# EAGLE design thit_draw103 (EAGLE 9.6.2)
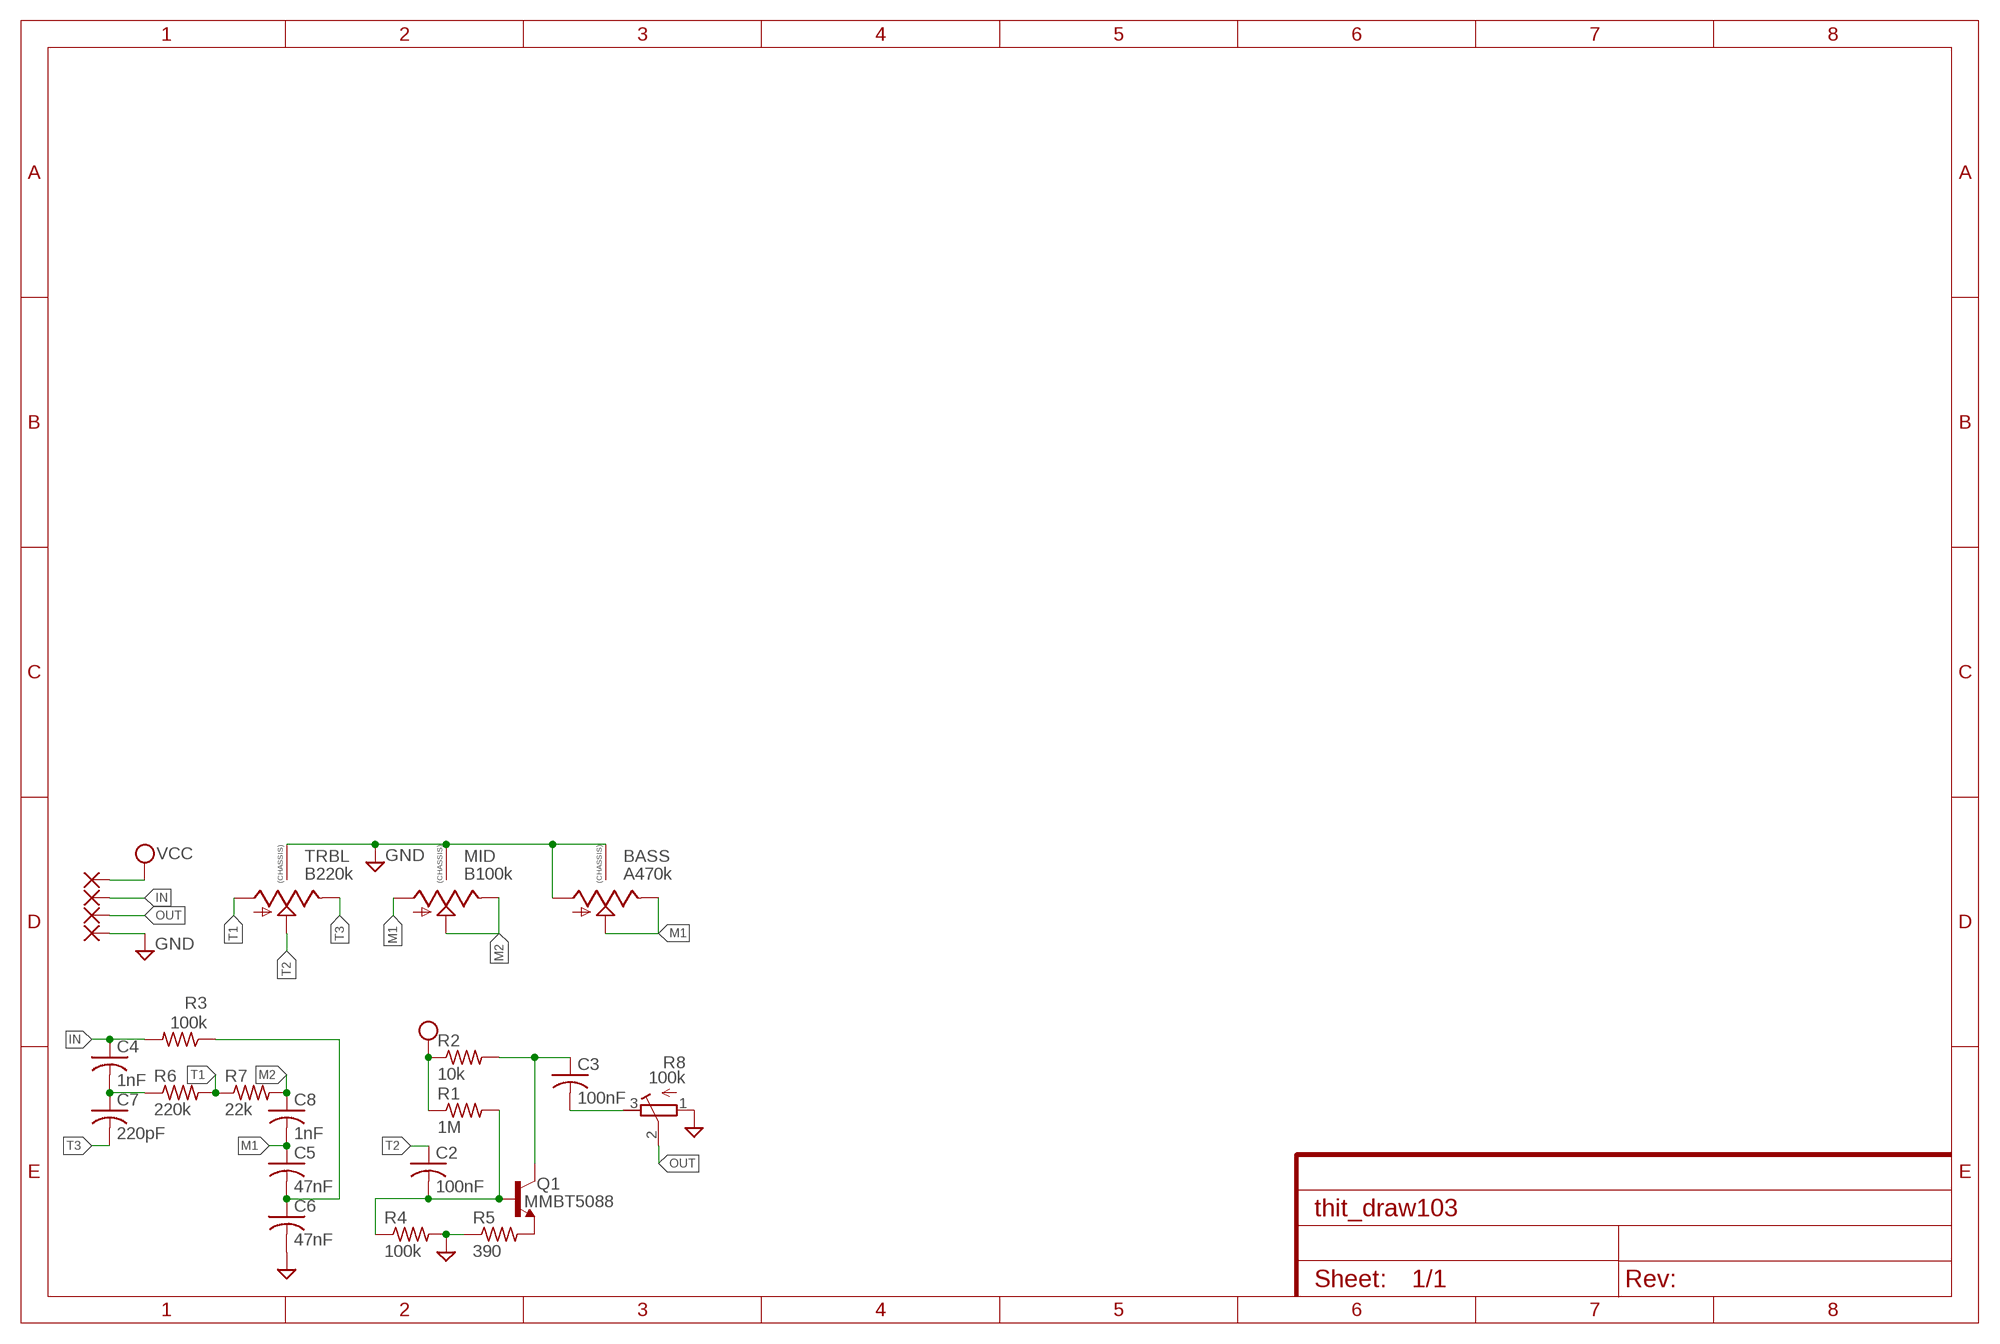
[diagram p0: schematic, sheet 1]

## Parts
BASS  A470k  9MM_SNAP-IN_POT_CHASSIS  [9MM_SNAP-IN_POT]
C2  100nF  C-USC0603  [C0603]
C3  100nF  C-USC0603  [C0603]
C4  1nF  C-USC0603  [C0603]
C5  47nF  C-USC0603  [C0603]
C6  47nF  C-USC0603  [C0603]
C7  220pF  C-USC0603  [C0603]
C8  1nF  C-USC0603  [C0603]
MID  B100k  9MM_SNAP-IN_POT_CHASSIS  [9MM_SNAP-IN_POT]
PAD1  1,6/0,8  [1,6/0,8]
PAD2  1,6/0,8  [1,6/0,8]
PAD3  1,6/0,8  [1,6/0,8]
PAD4  1,6/0,8  [1,6/0,8]
Q1  MMBT5088  [SOT23-BEC]
R1  1M  R-US_R0603  [R0603]
R2  10k  R-US_R0603  [R0603]
R3  100k  R-US_R0603  [R0603]
R4  100k  R-US_R0603  [R0603]
R5  390  R-US_R0603  [R0603]
R6  220k  R-US_R0603  [R0603]
R7  22k  R-US_R0603  [R0603]
R8  100k  R-TRIMM3224X  [RTRIM3224X]
TRBL  B220k  9MM_SNAP-IN_POT_CHASSIS  [9MM_SNAP-IN_POT]

## Nets
GND: BASS.1(A) BASS.CHASSIS1 BASS.CHASSIS2 C6.2 MID.CHASSIS1 MID.CHASSIS2 PAD4.1(P) R4.2 R5.1 R8.1(A) TRBL.CHASSIS1 TRBL.CHASSIS2
IN: C4.1 PAD2.1(P) R3.2
M1: BASS.2(S) BASS.3(E) C5.1 C8.2 MID.1(A)
M2: C8.1 MID.2(S) MID.3(E) R7.2
N$1: C2.2 Q1.B R1.2 R4.1
N$2: C4.2 C7.1 R6.1
N$3: C5.2 C6.1 R3.1
N$4: Q1.E R5.2
N$5: C3.1 Q1.C R2.2
N$6: C3.2 R8.3(E)
OUT: PAD3.1(P) R8.2(S)
T1: R6.2 R7.1 TRBL.1(A)
T2: C2.1 TRBL.2(S)
T3: C7.2 TRBL.3(E)
VCC: PAD1.1(P) R1.1 R2.1

## Library data of the parts
BASS MID TRBL = MusicThingModular:9MM_SNAP-IN_POT_CHASSIS: 9mm vertical snap-in pot, Alpha / Panasonic style, with a connection to the metal chassis for grounding
C2-C8 = adafruit:C-US: CAPACITOR, American symbol
PAD1-PAD4 = wirepad:1,6/0,8: THROUGH-HOLE PAD
Q1 = MMBT5088_:MMBT5088*: NPN TRANSISTOR Check prices <https://pricing.snapeda.com/search/part/MMBT5088/?ref=eda>; AVAILABILITY: Good; DESCRIPTION: Bipolar (BJT) Transistor NPN 30V 100mA 50MHz 350mW Surface Mount SOT-23; MF: ON Semiconductor; MP: MMBT5088; PACKAGE: SOT-23-3 Fairchild Semiconductor; PRICE: None; PURCHASE-URL: https://pricing.snapeda.com/search/part/MMBT5088/?ref=eda
R1-R7 = adafruit:R-US_: RESISTOR, American symbol
R8 = rcl:R-TRIMM: Trimm resistor; SPICEMODEL: X; SPICEPREFIXL: POT

## Board
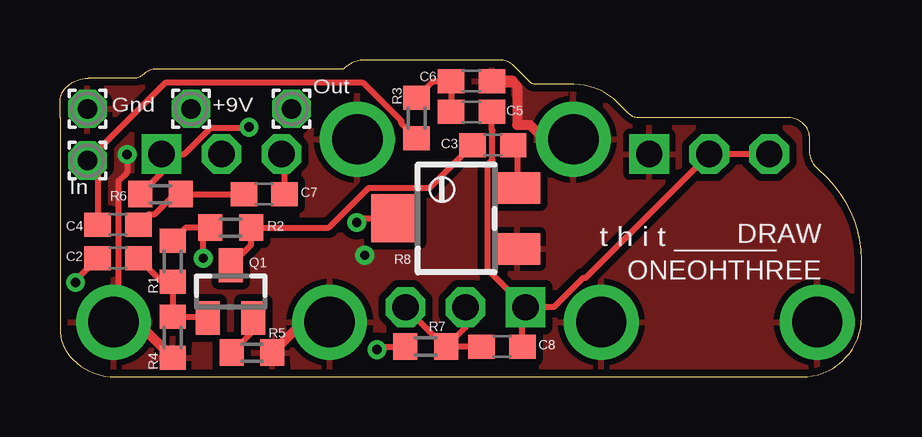
[diagram p1: board, top side]
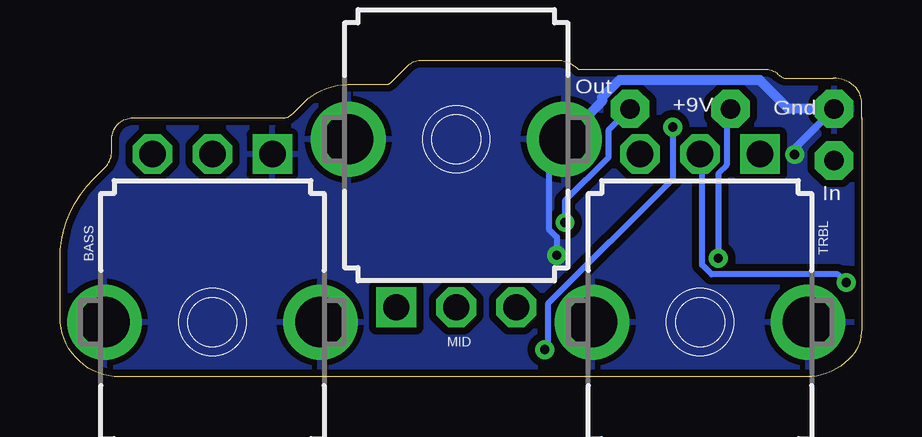
[diagram p2: board, bottom side, seen from below]

Size 33.4 x 13.21 mm. Coordinates in mm from the lower left corner, seen from the top.
Outline: 0,10.79 0,3.05 0,1.99 arc45 0.51,0.76 0.54,0.73 arc45 2.31,0 2.41,0 30.9,0 arc90 33.4,2.5 33.4,4.88 arc45 32,8.26 31.51,8.75 arc-45 31.24,9.4 31.24,9.93 arc45 30.99,10.54 arc45 30.38,10.79 24.13,10.79 arc-45 23.7,10.97 23.24,11.43 arc45 21.4,12.19 19.81,12.19 arc-45 19.59,12.28 18.92,12.95 arc45 18.31,13.21 12.73,13.21 arc45 11.81,12.83 4.04,12.83 arc45 3.43,12.57 arc-45 3.12,12.45 1.17,12.45 arc45 0.25,12.06 arc45 0,11.45 0,10.79
Copper layers (1*16): Top 0.035mm / dielectric 1.5mm / Bottom 0.035mm
Design rules "default *": minimum track width 6mil, minimum drill 0.35mm, track to track 6mil, track to pad 6mil, pad to pad 6mil, via to via 6mil, smd to smd 6mil, copper to edge 10mil, drill to drill 6mil, minimum pad ring 10mil, minimum via ring 8mil, stop-mask expansion 4mil, vias tented up to drill 0mil, thermal gap 10mil

### Footprints (pad centres in the part's own frame; a part is rotated, then mirrored left to right if it is on the bottom)
9MM_SNAP-IN_POT = drill 1.1 square: 1 -2.5,-7 | drill 1.1 octagon: 2 0,-7; 3 2.5,-7 | drill 2.1 pad 2.794: CHASSIS1 -4.5,0; CHASSIS2 4.5,0
C0603 = smd 1.1 x 1: 1 -0.85,0; 2 0.85,0
1,6/0,8 = drill 0.813 pad 1.6 octagon: 1 0,0
SOT23-BEC = smd 1 x 1.4: B -0.95,-1.1; C 0,1.1; E 0.95,-1.1
R0603 = smd 1 x 1.1: 1 -0.85,0; 2 0.85,0
RTRIM3224X = smd 1.32 x 1.9: 1 -1.27,-2.54; 3 1.27,-2.54 | smd 2 x 2: 2 0,2.54

### Placement (x,y rotation side)
BASS  27.05,2.29 180 bottom
C2  2.41,4.95 0 top
C3  18.03,9.65 0 top
C4  2.41,6.35 0 top
C5  17.14,11.05 180 top
C6  17.14,12.32 0 top
C7  8.51,7.62 0 top
C8  18.41,1.27 0 top
MID  16.89,9.91 0 bottom
PAD1  5.46,11.18 0 top
PAD2  1.14,9.02 0 top
PAD3  9.65,11.18 0 top
PAD4  1.14,11.18 0 top
Q1  7.11,3.56 0 top
R1  4.7,4.83 270 top
R2  7.11,6.22 0 top
R3  14.86,10.79 270 top
R4  4.7,1.65 270 top
R5  8,1.02 180 top
R6  4.19,7.62 180 top
R7  15.24,1.27 0 top
R8  16.51,6.6 90 top
TRBL  6.73,2.29 180 bottom

### Tracks (layer width: path | path; a pad name or v marks a point on that pad's centre or on a via)
GND  (via drill 0.38)
  Top 0.254: v2.79,9.27 2.79,8.52 2.43,8.16 2.43,2.49 TRBL.CHASSIS1
  Top 0.406: 18.84,12.32 19.05,12.11 19.05,10.51 19.58,10.51 20.18,9.91 MID.CHASSIS1 | R5.1 10.12,2.29 TRBL.CHASSIS2 | R4.2 3.21,2.29 TRBL.CHASSIS1
  Top 0.508: C6.2 18.84,12.32
  Bottom 0.254: v12.7,5.08 12.7,5.83 13.03,6.16 13.03,9.27 MID.CHASSIS2
  Bottom 0.305: PAD4.1 2.79,9.53 v2.79,9.27
  Bottom 0.406: PAD4.1 3.05,11.18 4.24,12.37 10.09,12.37 10.81,11.65 10.81,11.49 MID.CHASSIS2
  pour Top (isolate 0.305): -1.27,13.97 -1.27,-1.27 35.56,-1.27 35.56,13.97
  pour Bottom (isolate 0.305): -1.27,13.97 -1.27,-1.27 35.56,-1.27 35.56,13.97
IN
  Top 0.254: R3.2 14.23,10.58 14.23,10.67 12.64,12.26 4.38,12.26 PAD2.1 1.56,8.6 C4.1
M1
  Top 0.254: C5.1 18,10.29 18.01,10.27 18.01,9.04 17.82,8.84 17.82,4.48 MID.1 | C8.2 19.27,2.78 MID.1 | BASS.3 BASS.2 21.89,4.12 21.79,4.12 20.57,2.91 MID.1
M2
  Top 0.254: C8.1 R7.2 | R7.2 16.89,2.07 MID.2 | MID.3 16.03,1.27 R7.2
N$1
  Top 0.254: C2.2 4.24,3.98 R1.2 R4.1 6.12,2.5 Q1.B
N$2
  Top 0.254: C7.1 R6.1 4.79,7.62 3.96,6.79 3.7,6.79 C4.2
N$3
  Top 0.254: R3.1 15.53,12.32 C6.1 C5.2
N$4
  Top 0.254: R5.2 8.06,1.93 Q1.E
N$5
  Top 0.254: Q1.C 7.96,5.51 R2.2 11.19,6.22 12.85,7.88 15.41,7.88 C3.1
N$6
  Top 0.254: C3.2 19.05,9.49 R8.3
OUT  (via drill 0.38)
  Top 0.254: v12.36,6.44 12.53,6.6 R8.2
  Bottom 0.254: PAD3.1 10.55,10.27 10.55,9.14 12.36,7.34 v12.36,6.44
T1  (via drill 0.38)
  Top 0.254: R6.2 4.23,8.51 TRBL.1 5.17,9.29 6.27,10.39 7.85,10.39 v7.87,10.41 | v13.21,1.14 13.34,1.27 R7.1
  Bottom 0.254: v13.21,1.14 13.07,1.28 13.07,3.05 7.87,8.24 v7.87,10.41
T2  (via drill 0.38)
  Top 0.254: C2.1 0.65,4.04 v0.65,3.94
  Bottom 0.254: v0.65,3.94 0.99,4.28 6.25,4.28 6.64,4.67 6.64,9.2 TRBL.2
T3
  Top 0.254: C7.2 9.36,9.16 TRBL.3
VCC  (via drill 0.38)
  Top 0.254: R2.1 6.1,6.22 | 6.1,6.22 5.25,6.22 R1.1 | v5.97,4.95 5.97,6.1 6.1,6.22
  Bottom 0.254: v5.97,4.95 5.97,8.49 5.63,8.83 5.63,11.01 PAD1.1

### Text on the board
tPlace: Out | Gnd | +9V | In | DRAW | t h i t ______ | ONEOHTHREE
bPlace: Out | Gnd | +9V | In